# Altium schematic sheet Charger.SchDoc
size A4; SheetNumber: 6; SheetTotal: 6
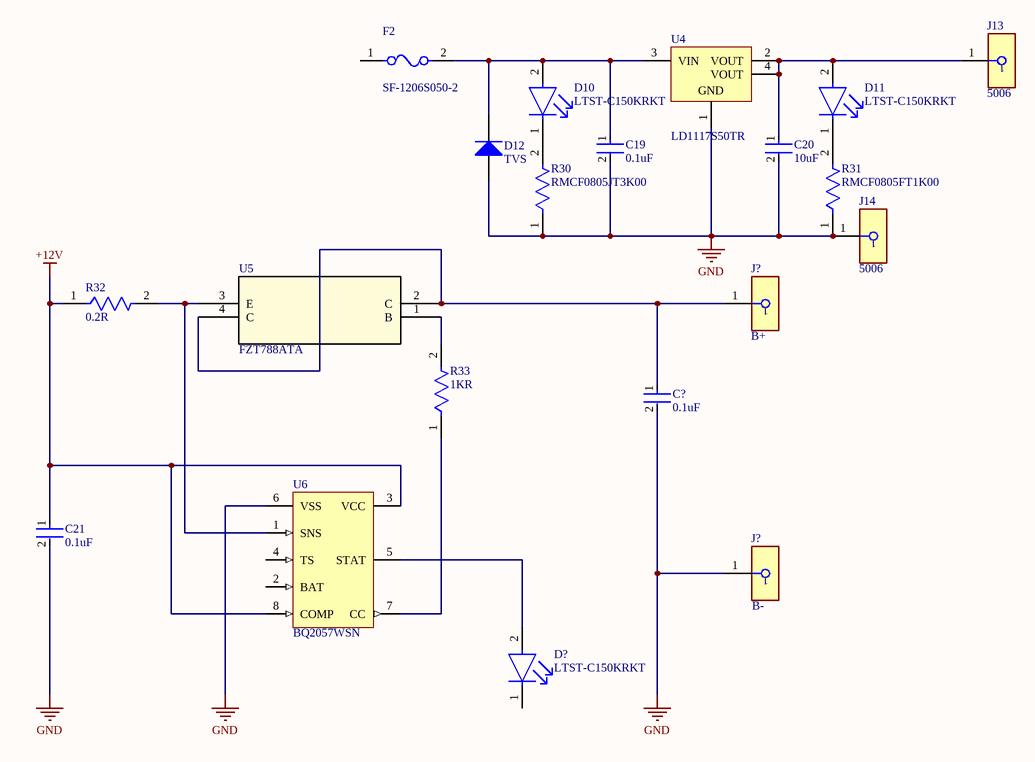
[diagram p0: Charger.SchDoc]

## Parts
(Parts that share a designator on the sheet are numbered #1, #2 ... from top to bottom, then left to right.)
C19  0.1uF  [FP-C0805C-DN-MFG]
C20  10uF  [FP-C0805C106J8RACAUTO-MFG]
C21  0.1uF  [FP-C0805C-DN-MFG]
C?  0.1uF  [FP-C0805C-DN-MFG]
D10  LTST-C150KRKT  [FP-LTST-C150KRKT-MFG]
D11  LTST-C150KRKT  [FP-LTST-C150KRKT-MFG]
D12  TVS  [VISH-DO-214AC-2_L]
D?  LTST-C150KRKT  [FP-LTST-C150KRKT-MFG]
F2  SF-1206S050-2  [FP-SF-1206S-MFG]
J13  5006  [FP-5006-MFG]
J14  5006  [FP-5006-MFG]
J?#1  B+  [FP-5006-MFG]
J?#2  B-  [FP-5006-MFG]
R30  RMCF0805JT3K00  [FP-RMCF0805-IPC_C]
R31  RMCF0805FT1K00  [FP-RMCF0805-IPC_C]
R32  0.2R  [FP-LTR10-MFG]
R33  1KR  [FP-RMCF0805-IPC_C]
U4  LD1117S50TR  [SOT-223_L]
U5  FZT788ATA  [SOT-223_DIO]
U6  BQ2057WSN  [D0008A_N]

## Nets
+12V: C21.1 R32.1 U6.3(VCC) U6.8(COMP)
GND: C19.2 C20.2 C21.2 C?.2 D12.2(A) J14.1 J?#2.1 R30.1 R31.1 U4.1(GND) U6.6(VSS)
NetC19_1: C19.1 D10.2(A) D12.1(K) F2.2 U4.3(VIN)
NetC20_1: C20.1 D11.2(A) J13.1 U4.2(VOUT) U4.4(VOUT)
NetC?_1: C?.1 J?#1.1 U5.2(C) U5.4(C)
NetD10_1: D10.1(C) R30.2
NetD11_1: D11.1(C) R31.2
NetD?_2: D?.2(A) U6.5(STAT)
NetR32_2: R32.2 U5.3(E) U6.1(SNS)
NetR33_1: R33.1 U6.7(CC)
NetR33_2: R33.2 U5.1(B)

Not connected (* = marked no-connect by the designer): D? 1(C); F2 1; U6 2(BAT) 4(TS)

## Library data of the parts
C19 C21 C? = CMP-03020-000950-1: CAP CER 0.1UF 50V X7R 0805; Manufacturer: KEMET; Manufacturer Part Number: C0805C104J5RACTU; Temperature Coefficient: 30ppm/°C; Value: 0.10 μF; Material: Ceramic; Tolerance: 0.05; Voltage Rating: 50 V; Digikey Description: CAP CER 0.1UF 50V X7R 0805; Octopart: https://octopart.com/c0805c104j5ractu-kemet-104634; RoHS: TRUE; Device Class L1: Passive Components; Temperature Characteristic: X7R; Device Class L3: Ceramic Capacitors; Lead Free: Yes; Automotive: No; Category: Cap; Temperature: -55°C to +125°C; Package: C0805C-DN; Temperature Range High: +125°C; Height: 0.88mm; Capacitance: 0.10 μF; Temperature Range Low: -55°C; ComponentLink2Description: Datasheet; ComponentLink2URL: https://content.kemet.com/datasheets/KEM_C1003_C0G_SMD.pdf; Ipc Land Pattern Name: CAPC200125X78; Device Class L2: Capacitors; Mouser Description: Multilayer Ceramic Capacitors MLCC - SMD/SMT 50volts 0.1uF X7R 5%
C20 = CMP-03020-034708-1: CAP CER 10UF 10V X7R 0805; Tolerance: 5%; Mount: Surface Mount; Capacitance: 10uF; Voltage Rating: 10V; Max Operating Temperature: 125°C; Min Operating Temperature: -55°C; Case/Package: 0805; RoHS Compliant: Yes; Packaging: Tape and Reel; Case Code (Imperial): 0805; Case Code (Metric): 2012; Ratings: AEC-Q200
D10 D11 D? = CMP-2000-06617-2: LED RED CLEAR 1206 SMD; Wavelength: 639nm; Power Dissipation: 62.5mW; Luminous Intensity: 54mcd; Test Current: 20mA; Forward Current: 30mA; Reverse Voltage: 5V; Viewing Angle: 130°; Number of Elements: 1; Lens Style: Diffused; Power Rating: 75mW; Lens Color: Colorless; Forward Voltage: 2V; Dominant Wavelength: 631nm; Depth: 1.6mm; Mount: Surface Mount; Packaging: Tape and Reel; Case Code (Metric): 3216; Lens Transparency: Clear; Illumination Color: Red; Radiation Hardening: No; Min Operating Temperature: -30°C; Height: 1.1mm; Case Code (Imperial): 1206; Number of Pins: 2; Length: 3.2mm; Lead Free: Lead Free; Color: Red; Width: 1.6mm; Number of LEDs: 1; Max Operating Temperature: 85°C; Case/Package: 1206; Package Quantity: 1
D12 = CMP-0548-00238-2: Transient Voltage Suppressor, 6.40 to 231 V, 10 V Stand-off Voltage, Uni-Directional, -55 to 155 degC, 2-pin DO-214AC, Pb-Free, Tape and Reel; PartNumber: SMAJ10A-E3/61; Manufacturer: Vishay Semiconductor; VBR Uni-Directional (V): 6.4 to 231; ID (uA): 1; IFSM: 40 A; VWM (V): 10; PPPM (W): 400, 300; PackageReference: DO-214AC-2; ComponentLink2URL: http://www.vishay.com/docs/88390/smaj50a.pdf; Operating Junction and Storage Temperature Range: -55 to 150 degC; DatasheetVersion: 12/8/2013; ComponentLink3URL: http://www.vishay.com/docs/88390/smaj50a.pdf; ComponentLink1Description: Manufacturer URL; ComponentLink1URL: http://www.vishay.com/; PackageDescription: 2-Pin DO-214AC (SMA), Body 4.245 x 2.665 mm; ComponentLink3Description: Package Specification; RoHS: TRUE; Packing: Tape and Reel; Mounting Technology: Surface Mount; ComponentLink2Description: Datasheet
F2 = CMP-07399-000002-1: FUSE BOARD MNT 500MA 63VDC 1206; Manufacturer: Bourns; Fuse Blow Speed: Slow; Voltage Rating: 63V; Value: 596mΩ; Fuse Interrupt Dc Current: 50A; Fuse I2T: 0.03A2Sec; Fuse Current: 0.5A; Digikey Description: FUSE BOARD MNT 500MA 63VDC 1206; ComponentLink2Description: Datasheet; Temperature: -20°C to +105°C; Category: Fuse; Device Class L2: Fuses; Device Class L3: unset; ComponentLink2URL: https://www.bourns.com/docs/product-datasheets/sf-1206s.pdf?sfvrsn=e6b376e3_33; RoHS: TRUE; Package: SF-1206S; Height: 0.7mm; Octopart: https://octopart.com/sf-1206s050-2-bourns-8398336; Manufacturer Part Number: SF-1206S050-2; Ipc Land Pattern Name: CAPC310155X60; Temperature Range Low: -20°C; Lead Free: Yes; Max Fuse Dc Voltage: 63V; Automotive: No; Device Class L1: Circuit Protection; Mouser Description: Fuse Chip Slow Blow Acting 0.5A 63V SMD Solder Pad 1206 T/R UL; Resistance: 596mΩ; Temperature Range High: +105°C
J13 J14 J?#1 J?#2 = CMP-19636-000022-1: PC TEST POINT COMPACT BLACK; Body Material: Bronze; Inside Diameter: 1.78mm; Number of Ports: 1; Hole Diameter: 1.6mm; Outside Diameter: 3.18mm; Plating: Silver; Contact Plating: Tin; Color: Black; RoHS Compliant: Yes; Flammability Rating: UL94 V-0; Contact Material: Bronze; Material: Nylon; Orientation: Straight; Package Quantity: 100; Housing Color: Black; Length: 8.89mm; Series: THM; Mount: PCB; Height: 0.35inch; Packaging: Bulk; REACH SVHC: No SVHC; Insulation Material: Nylon; Lead Free: Lead Free
R30 = CMP-26527-006913-1: 3kΩ ±5% 0.125W 0805 Thick Film Chip Resistor AEC-Q200 compliant; Max Power Dissipation: 125mW; Resistance: 3kR; Temperature Coefficient: 200ppm/°C; Military Standard: Not; Case Code (Metric): 2012; Tolerance: 5%; Depth: 1.25mm; Case Code (Imperial): 0805; Contact Plating: Tin; Packaging: Tape and Reel; Height: 0.026inch; RoHS Compliant: Yes; Number of Terminations: 2; Case/Package: 0805; Mount: Surface Mount; Resistor Type: Thick Film; Min Operating Temperature: -55°C; Series: RMCF; Features: Automotive AEC-Q200; Max Operating Temperature: 155°C; Radiation Hardening: No; Width: 0.049inch; Length: 0.079inch; Construction: Rectangular
R31 = CMP-26527-002331-1: 1kΩ ±1% 0.125W 0805 Thick Film Chip Resistor AEC-Q200 compliant; Resistance: 1kR; Max Power Dissipation: 125mW; Temperature Coefficient: 100ppm/°C; Contact Plating: Tin; Case Code (Imperial): 0805; Radiation Hardening: No; Case/Package: 0805; Min Operating Temperature: -55°C; Construction: Rectangular; Tolerance: 1%; Length: 2mm; Features: Automotive AEC-Q200; Height: 0.026inch; Mount: Surface Mount; Series: RMCF; Number of Terminations: 2; Width: 0.049inch; Packaging: Tape and Reel; Size Code: 0805; Lead Free: Lead Free; Depth: 1.25mm; Power Rating: 125mW; Resistor Type: Thick Film; Case Code (Metric): 2012; Military Standard: Not; Max Operating Temperature: 155°C; RoHS Compliant: Yes
R32 = CMP-08839-000006-1: RES 0.2 OHM 1/2W 0805 WIDE; 3DS Part Number: 110-00000; Manufacturer: ROHM; Manufacturer Part Number: LTR10EVHJLR20; Automotive Grade: Grade 0; Description: RES SMD 0.2 OHM 1/2W 0805 WIDE; Tolerance: 5%; Value: 200mΩ; Temperature Coefficient: 150ppm/°C; Power Rating: 0.5W; Height: 0.65mm; Device Class L2: Resistors; Octopart: https://octopart.com/ltr10evhjlr20-rohm-20377540; Ipc Land Pattern Name: RESC120200X55; Temperature: -55°C to +155°C; Device Class L3: Chip SMD Resistors; Temperature Range Low: -55°C; RoHS: TRUE; Series: LTR; Lead Free: Yes; Category: Res; Composition: Thick Film; Temperature Range High: +155°C; ComponentLink2Description: Datasheet; Package: LTR10; Device Class L1: Passive Components; Digikey Description: RES 0.2 OHM 1/2W 0805 WIDE; ComponentLink2URL: https://www.rohm.com/datasheet/LTR10EVHJL/ltr-low-e; Automotive: Yes; Resistance: 200mΩ
R33 = CMP-26527-002331-1: 1kΩ ±1% 0.125W 0805 Thick Film Chip Resistor AEC-Q200 compliant; Max Power Dissipation: 125mW; Temperature Coefficient: 100ppm/°C; Contact Plating: Tin; Case Code (Imperial): 0805; Radiation Hardening: No; Case/Package: 0805; Min Operating Temperature: -55°C; Construction: Rectangular; Resistance: 1kR; Tolerance: 1%; Length: 2mm; Features: Automotive AEC-Q200; Height: 0.026inch; Mount: Surface Mount; Series: RMCF; Number of Terminations: 2; Width: 0.049inch; Packaging: Tape and Reel; Size Code: 0805; Lead Free: Lead Free; Depth: 1.25mm; Power Rating: 125mW; Resistor Type: Thick Film; Case Code (Metric): 2012; Military Standard: Not; Max Operating Temperature: 155°C; RoHS Compliant: Yes
U4 = CMP-0244-00312-1: Fixed Low Drop Positive Voltage Regulator, 5V, 4-Pin SOT-223, Tape and Reel; ComponentLink1URL: http://www.st.com; DatasheetVersion: 1/11/2011; PackageDescription: 4-Pin SOT-223 Package, 6.5 x 3.5 mm Body, 2.3 mm Pitch, 7 mm Lead Span; ComponentLink2URL: http://www.st.com/internet/com/TECHNICAL_RESOURCES/TECHNICAL_LITERATURE/DATASHEET/CD00000544.pdf; ComponentLink1Description: Manufacturer URL; PackageReference: SOT-223; PackageVersion: 2010; ComponentLink2Description: Datasheet
U5 = FZT788ATA: No Description Available; Mfr_Name: Diodes Inc; RefDes: RefDes; Type: Type
U6 = CMP-0321-00344-2: Low Dropout Linear 2-Cell Li-Ion Charge Controller with AutoCompTM, 8.4 V, 4.5 V, -20 to 70 degC, 8-pin SOIC (D), Green (RoHS & no Sb/Br); Manufacturer: Texas Instruments; Over Voltage Protection: N; SubFamily: Battery Charge Management; Vin(Min)(V): 4.5; Li-Polymer: Y; Mounting Technology: Surface Mount; PackageDescription: 8-Pin Plastic Small Outline Integrated Circuit, 4.9 x 3.9 mm, Pitch 1.27 mm Pitch; NiCd: N; ComponentLink1Description: Datasheet; PackageVersion: revM, Jun-2011; Eco-Plan: Green (RoHS & no Sb/Br); ComponentLink1URL: http://www.ti.com/general/docs/lit/getliterature.tsp?genericPartNumber=BQ2057W&fileType=pdf; NiMH: N; Code_JEDEC: MS-012AA; Lead Acid: N; PackageReference: D0008A; PartNumber: BQ2057WSN; Li-Ion: Y; DatasheetVersion: SLUS025F